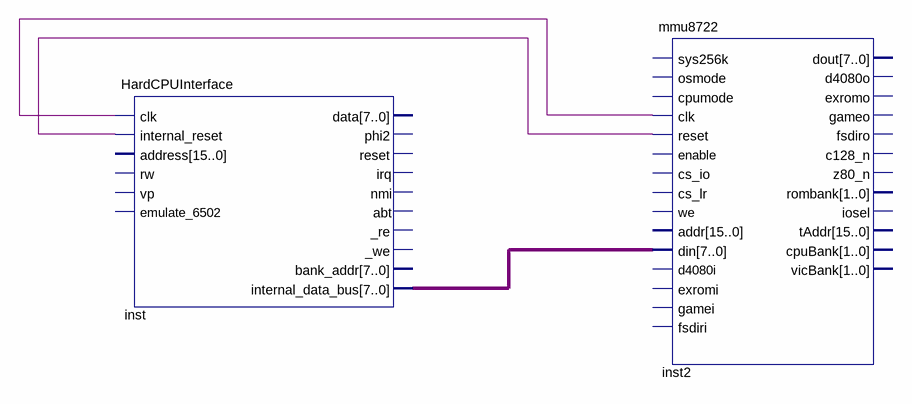
[diagram p0: schematic sheet]
// Quartus schematic TT8BG_top.bdf as structural Verilog: 2 symbols, 0 pins
module TT8BG_top (
);

  wire undriven, undriven_2;
  wire [7:0] inst_internal_data_bus;

  HardCPUInterface inst (
    .clk(undriven_2), .internal_reset(undriven), .internal_data_bus(inst_internal_data_bus));  // open: address, rw, vp, emulate_6502, phi2, reset, irq, nmi, abt, _re, _we, bank_addr, data
  mmu8722 inst2 (
    .clk(undriven_2), .reset(undriven), .din(inst_internal_data_bus));  // open: sys256k, osmode, cpumode, enable, cs_io, cs_lr, we, addr, d4080i, exromi, gamei, fsdiri, dout, d4080o, exromo, gameo, fsdiro, c128_n, z80_n, rombank, iosel, tAddr, cpuBank, vicBank
endmodule
